# EAGLE design HyperPower (EAGLE 9.2.0)
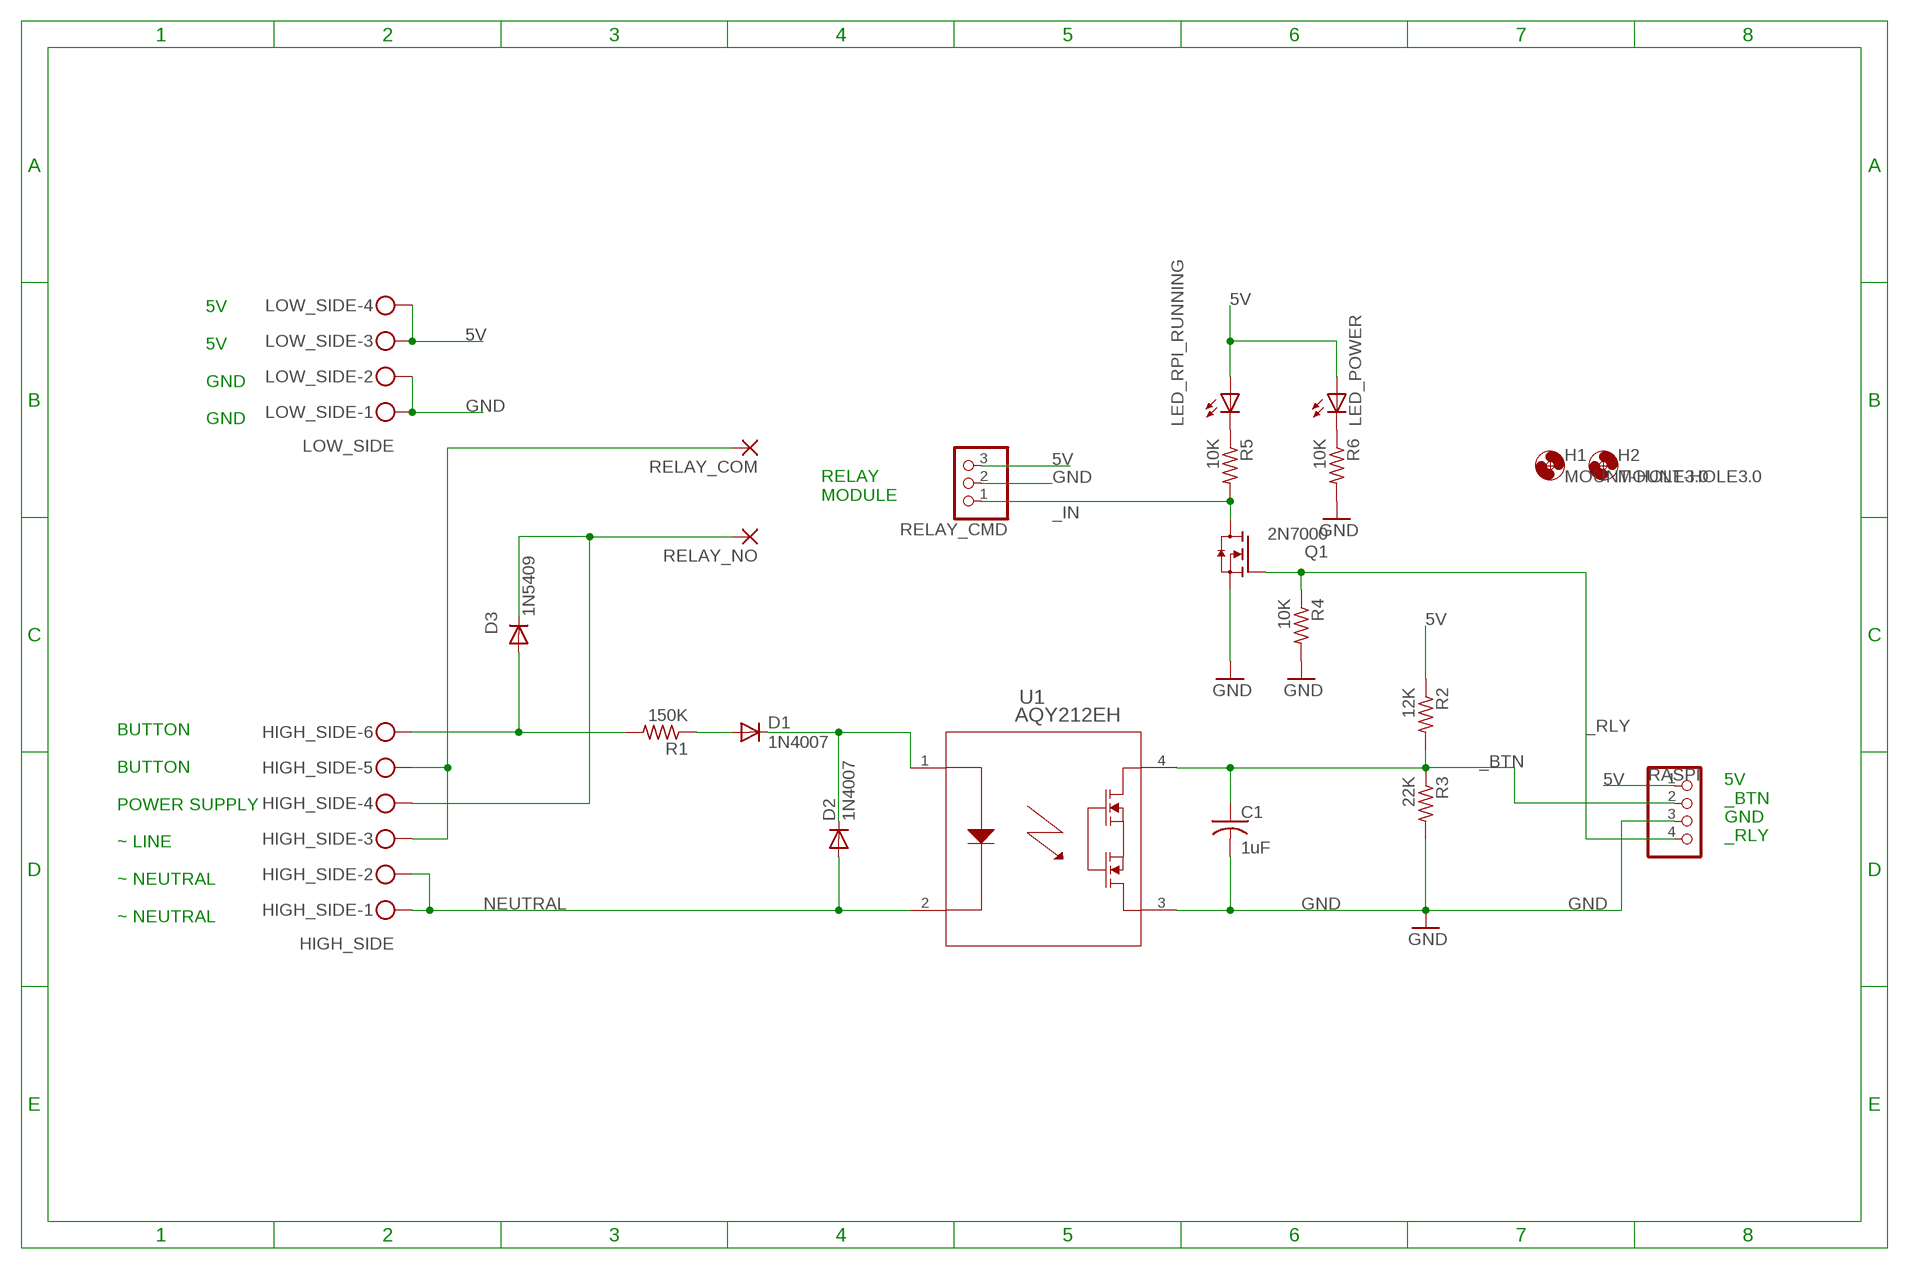
[diagram p0: schematic, sheet 1]

## Parts
C1  1uF  C-US025-040X050  [C025-040X050]
D1  1N4007  1N4004  [DO41-10]
D2  1N4007  1N4004  [DO41-10]
D3  1N5409  1N5400  [DO201-15]
H1  MOUNT-HOLE3.0  [3,0]
H2  MOUNT-HOLE3.0  [3,0]
HIGH_SIDE  HIGH_SIDE  MKDSN1,5/6-5,08  [MKDSN1,5/6-5,08]
LED_POWER  LED_ELD260  [LED_LD260]
LED_RPI_RUNNING  LED_ELD260  [LED_LD260]
LOW_SIDE  LOW_SIDE  MKDSN1,5/4-5,08  [MKDSN1,5/4-5,08]
Q1  2N7000  [TO92]
R1  150K  R-US_0207/10  [0207/10]
R2  12K  R-US_0207/10  [0207/10]
R3  22K  R-US_0207/10  [0207/10]
R4  10K  R-US_0207/10  [0207/10]
R5  10K  R-US_0207/10  [0207/10]
R6  10K  R-US_0207/10  [0207/10]
RASPI  PINHD-1X4  [1X04]
RELAY_CMD  PINHD-1X3  [1X03]
RELAY_COM  3,81/1,4  [3,81/1,4]
RELAY_NO  3,81/1,4  [3,81/1,4]
U1  AQY212EH  [PAN_AQY21-DIP4_PAN]

## Nets
5V: LED_POWER.A LED_RPI_RUNNING.A LOW_SIDE.3 LOW_SIDE.4 R2.1 RASPI.1 RELAY_CMD.3
_BTN: C1.1 R2.2 R3.1 RASPI.2 U1.4
_IN: Q1.3(D) R5.2 RELAY_CMD.1
_RLY: Q1.2(G) R4.1 RASPI.4
GND: C1.2 LOW_SIDE.1 LOW_SIDE.2 Q1.1(S) R3.2 R4.2 R6.2 RASPI.3 RELAY_CMD.2 U1.3
N$1: D1.C D2.C U1.1
N$2: HIGH_SIDE.3 HIGH_SIDE.5 RELAY_COM.1(P)
N$3: D3.A HIGH_SIDE.6 R1.2
N$4: D3.C HIGH_SIDE.4 RELAY_NO.1(P)
N$5: D1.A R1.1
N$6: LED_RPI_RUNNING.K(C) R5.1
N$7: LED_POWER.K(C) R6.1
NEUTRAL: D2.A HIGH_SIDE.1 HIGH_SIDE.2 U1.2

## Notes on the sheet
- 5V
  
  5V
  
  GND
  
  GND
- RELAY
  MODULE
- 5V
  _BTN
  GND
  _RLY
- BUTTON
  
  BUTTON
  
  POWER SUPPLY
  
  ~ LINE
  
  ~ NEUTRAL
  
  ~ NEUTRAL

## Library data of the parts
C1 = adafruit:C-US: CAPACITOR, American symbol
D1 D2 = adafruit:1N4004: DIODE General purpose 1N400x type rectifier (With bigger pads) http://www.ladyada.net/library/pcb/eaglelibrary.html
D3 = diode:1N5400: DIODE standard rectifier, 3 A, 50 V (Motorola)
H1 H2 = holes:MOUNT-HOLE: MOUNTING HOLE with drill center marker
HIGH_SIDE = con-phoenix-508:MKDSN1,5/6-5,08: MKDSN 1,5/ 6-5,08 Printklemme Nennstrom: 13,5 A Nennspannung: 250 V Rastermaß: 5,08 mm Polzahl: 6 Anschlussart: Schraubanschluss Montage: Löten Anschlussrichtung Leiter/Platine: 0 ° Artikelnummer: 1729160 Source: http://eshop.phoenixcontact.com .. 1729160.pdf
LED_POWER LED_RPI_RUNNING = eagle-ltspice:LED_E: LED Source: http://www.osram.convergy.de Source: www.luxeon.com Source: www.kingbright.com; SPICEMODEL: NONE; SPICEPREFIX: D; SPICETYPE: diode
LOW_SIDE = con-phoenix-508:MKDSN1,5/4-5,08: MKDSN 1,5/ 4-5,08 Printklemme Nennstrom: 13,5 A Nennspannung: 250 V Rastermaß: 5,08 mm Polzahl: 4 Anschlussart: Schraubanschluss Montage: Löten Anschlussrichtung Leiter/Platine: 0 ° Artikelnummer: 1729144 Source: http://eshop.phoenixcontact.com .. 1729144.pdf
Q1 = 2N7000:2N7000: Check prices <https://pricing.snapeda.com/parts/2N7000/STMicroelectronics/view-part?ref=eda>; AVAILABILITY: Good; DESCRIPTION: N-Channel 60V 350mA (Tc) 1W (Tc) Through Hole TO-92-3; MF: STMicroelectronics; MP: 2N7000; PACKAGE: E-PKG AXIAL-LEADED-2 ON Semiconductor; PRICE: None; PURCHASE-URL: https://pricing.snapeda.com/search/part/2N7000/?ref=eda
R1-R6 = adafruit:R-US_: RESISTOR, American symbol
RASPI = pinhead:PINHD-1X4: PIN HEADER
RELAY_CMD = pinhead:PINHD-1X3: PIN HEADER
RELAY_COM RELAY_NO = wirepad:3,81/1,4: THROUGH-HOLE PAD
U1 = AQY21-DIP:AQY212EH; BUILT_BY: EMA_UL_Team; MANUFACTURER_PART_NUMBER: AQY212EH; SOURCELIBRARY: Panasonic_2014-11-06; VENDOR: Panasonic

## Board
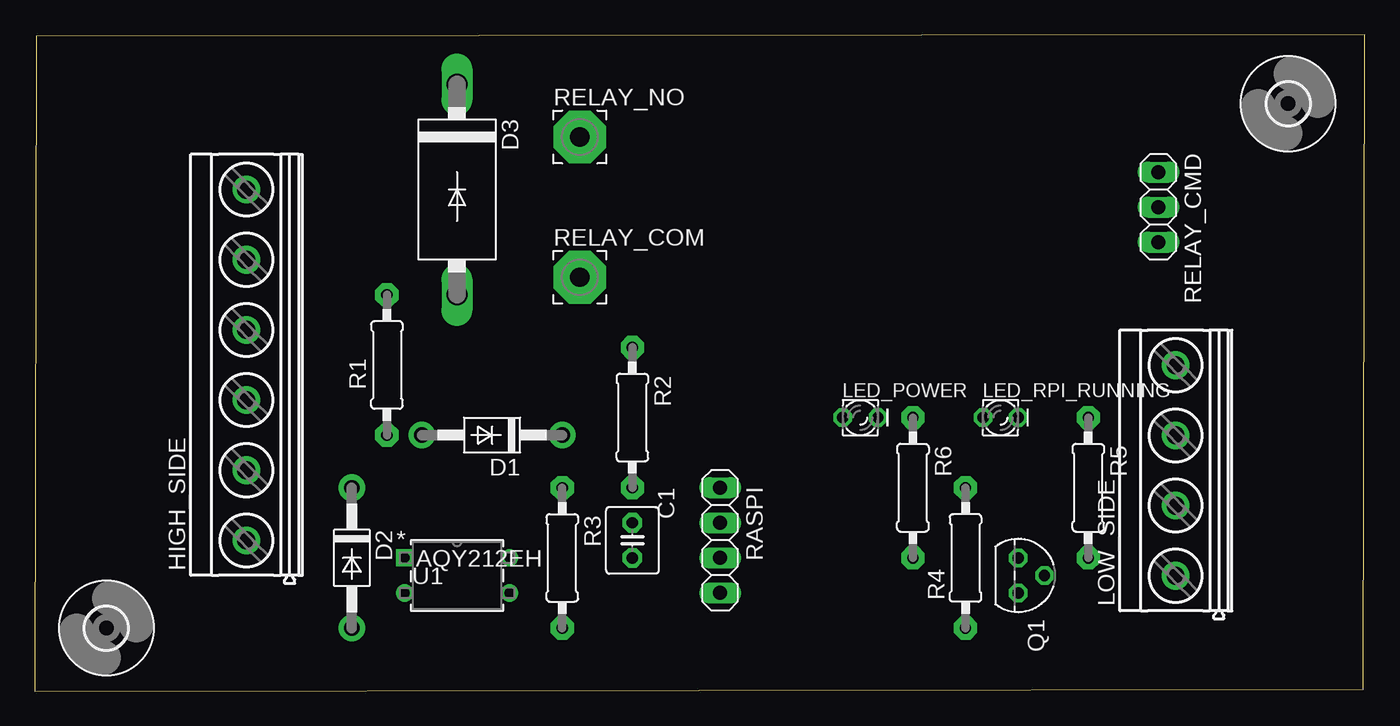
[diagram p1: board, top side]
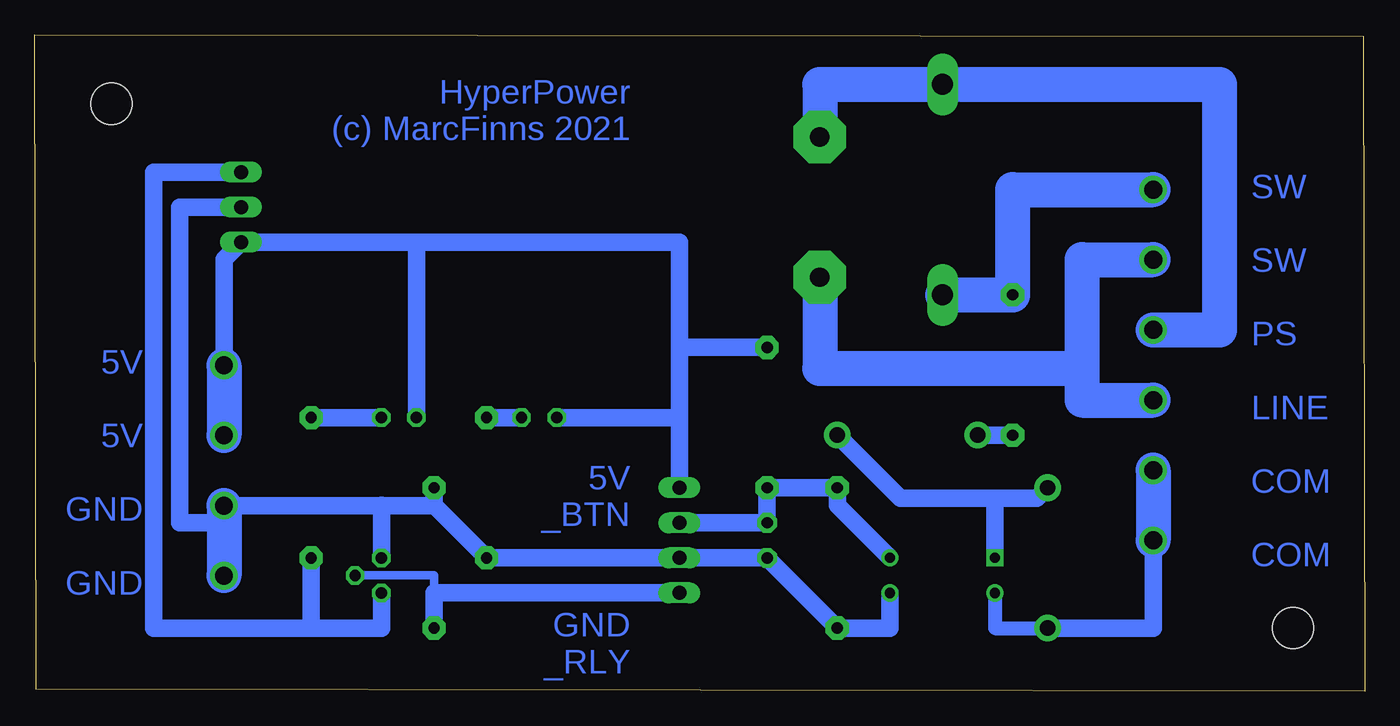
[diagram p2: board, bottom side, seen from below]

Size 96.37 x 47.55 mm. Coordinates in mm from the lower left corner, seen from the top.
Outline: 0,0 96.25,0.13 96.37,47.55 0.13,47.42 0,0
Copper layers (1*16): Top 0.035mm / dielectric 1.5mm / Bottom 0.035mm
Design rules "default": minimum track width 6mil, minimum drill 0.35mm, track to track 6mil, track to pad 6mil, pad to pad 6mil, via to via 6mil, smd to smd 6mil, copper to edge 40mil, drill to drill 6mil, minimum pad ring 10mil, minimum via ring 8mil, stop-mask expansion 4mil, vias tented up to drill 0mil, thermal gap 10mil

### Footprints (pad centres in the part's own frame; a part is rotated, then mirrored left to right if it is on the bottom)
C025-040X050 = drill 0.813 pad 1.422 octagon: 1 -1.27,0; 2 1.27,0
DO41-10 = drill 1.118 pad 1.93: A 5.08,0; C -5.08,0
DO201-15 = drill 1.499 long: A 7.62,0; C -7.62,0
3,0 = hole 3: 0,0
MKDSN1,5/6-5,08 = drill 1.3 pad 2: 1 -12.7,0.025; 2 -7.62,0.025; 3 -2.54,0.025; 4 2.54,0.025; 5 7.62,0.025; 6 12.7,0.025
LED_LD260 = drill 0.813 octagon: A -1.27,0; K 1.27,0
MKDSN1,5/4-5,08 = drill 1.3 pad 2: 1 -7.641,0.025; 2 -2.561,0.025; 3 2.519,0.025; 4 7.599,0.025
TO92 = drill 0.813 octagon: 1 -1.27,0; 2 0,1.905; 3 1.27,0
0207/10 = drill 0.813 pad 1.676 octagon: 1 -5.08,0; 2 5.08,0
1X04 = drill 1.016 long: 1 -3.81,0; 2 -1.27,0; 3 1.27,0; 4 3.81,0
1X03 = drill 1.016 long: 1 -2.54,0; 2 0,0; 3 2.54,0
3,81/1,4 = drill 1.397 pad 3.81 octagon: 1 0,0
PAN_AQY21-DIP4_PAN = drill 0.737 pad 1.245 square: 1 0,0 | drill 0.737 pad 1.245: 2 0,-2.54; 3 7.62,-2.54; 4 7.62,0

### Placement (x,y rotation side)
C1  43.31,10.92 270 top
D1  33.15,18.54 180 top
D2  22.99,9.65 270 top
D3  30.61,36.32 270 top
H1  5.21,4.57 0 top
H2  90.81,42.55 0 top
HIGH_SIDE  15.37,23.62 90 top
LED_POWER  59.82,19.81 0 top
LED_RPI_RUNNING  69.98,19.81 0 top
LOW_SIDE  82.68,16 90 top
Q1  71.25,8.38 270 top
R1  25.53,23.62 90 top
R2  43.31,19.81 270 top
R3  38.23,9.65 270 top
R4  67.44,9.65 90 top
R5  76.33,14.73 270 top
R6  63.63,14.73 270 top
RASPI  49.66,10.92 270 top
RELAY_CMD  81.41,35.05 270 top
RELAY_COM  39.5,29.97 0 top
RELAY_NO  39.5,40.13 0 top
U1  26.8,9.65 0 top

### Tracks (layer width: path | path; a pad name or v marks a point on that pad's centre or on a via)
5V
  Bottom 1.27: LOW_SIDE.4 82.65,31.27 RELAY_CMD.3 68.71,32.51 | 49.66,24.89 49.66,32.51 68.71,32.51 | 49.66,24.89 49.66,19.81 | 49.66,19.81 RASPI.1 | 49.66,24.89 R2.1 | LED_POWER.A 49.66,19.81 | LED_RPI_RUNNING.A 68.71,32.51
  Bottom 2.54: LOW_SIDE.4 LOW_SIDE.3
_BTN
  Bottom 1.27: U1.4 38.23,13.46 R3.1 R2.2 C1.1 RASPI.2
_IN
  Bottom 1.27: RELAY_CMD.1 87.76,37.59 87.76,4.57 76.33,4.57 | 76.33,4.57 71.25,4.57 Q1.3 | R5.2 76.33,4.57
_RLY
  Bottom 0.61: Q1.2 67.44,8.38 67.44,7.11
  Bottom 1.27: RASPI.4 66.17,7.11 67.44,7.11 67.44,5.84 R4.1
GND
  Bottom 0.152: 67.46,13.44 67.44,13.46
  Bottom 1.27: U1.3 34.42,4.57 R3.2 C1.2 RASPI.3 R6.2 67.44,13.46 R4.2 | RELAY_CMD.2 85.85,35.05 85.85,12.19 82.65,12.19 | LOW_SIDE.2 71.25,13.44 | 71.25,13.46 71.25,13.44 | 71.25,13.44 Q1.1 | 71.25,13.44 67.46,13.44
  Bottom 2.54: LOW_SIDE.1 82.65,12.19 LOW_SIDE.2 82.65,13.46
N$1
  Bottom 1.27: D1.C 33.66,13.97 26.8,13.97 | 26.8,13.97 U1.1 | 26.8,13.97 23.75,13.97 D2.C
N$2
  Bottom 0.152: RELAY_COM.1 39.45,30.02
  Bottom 2.54: 20.5,23.37 20.5,31.24 HIGH_SIDE.5 | 20.5,23.37 20.5,21.08 HIGH_SIDE.3 | RELAY_COM.1 39.5,23.37 20.5,23.37
N$3
  Bottom 2.54: HIGH_SIDE.6 25.53,36.32 R1.2 D3.A
N$4
  Bottom 2.54: HIGH_SIDE.4 10.54,26.16 10.54,43.94 D3.C 39.5,43.94 RELAY_NO.1
N$5
  Bottom 1.27: D1.A R1.1
N$6
  Bottom 1.27: R5.1 LED_RPI_RUNNING.K
N$7
  Bottom 1.27: R6.1 LED_POWER.K
NEUTRAL
  Bottom 1.016: D2.A 26.8,4.57 U1.2
  Bottom 1.27: D2.A 15.34,4.57 HIGH_SIDE.1
  Bottom 2.54: HIGH_SIDE.2 HIGH_SIDE.1

### Text on the board
Bottom: HyperPower / (c) MarcFinns 2021 | 5V / / 5V / / GND / / GND | 5V / _BTN / / / GND / _RLY | SW / / SW / / PS / / LINE / / COM / / COM